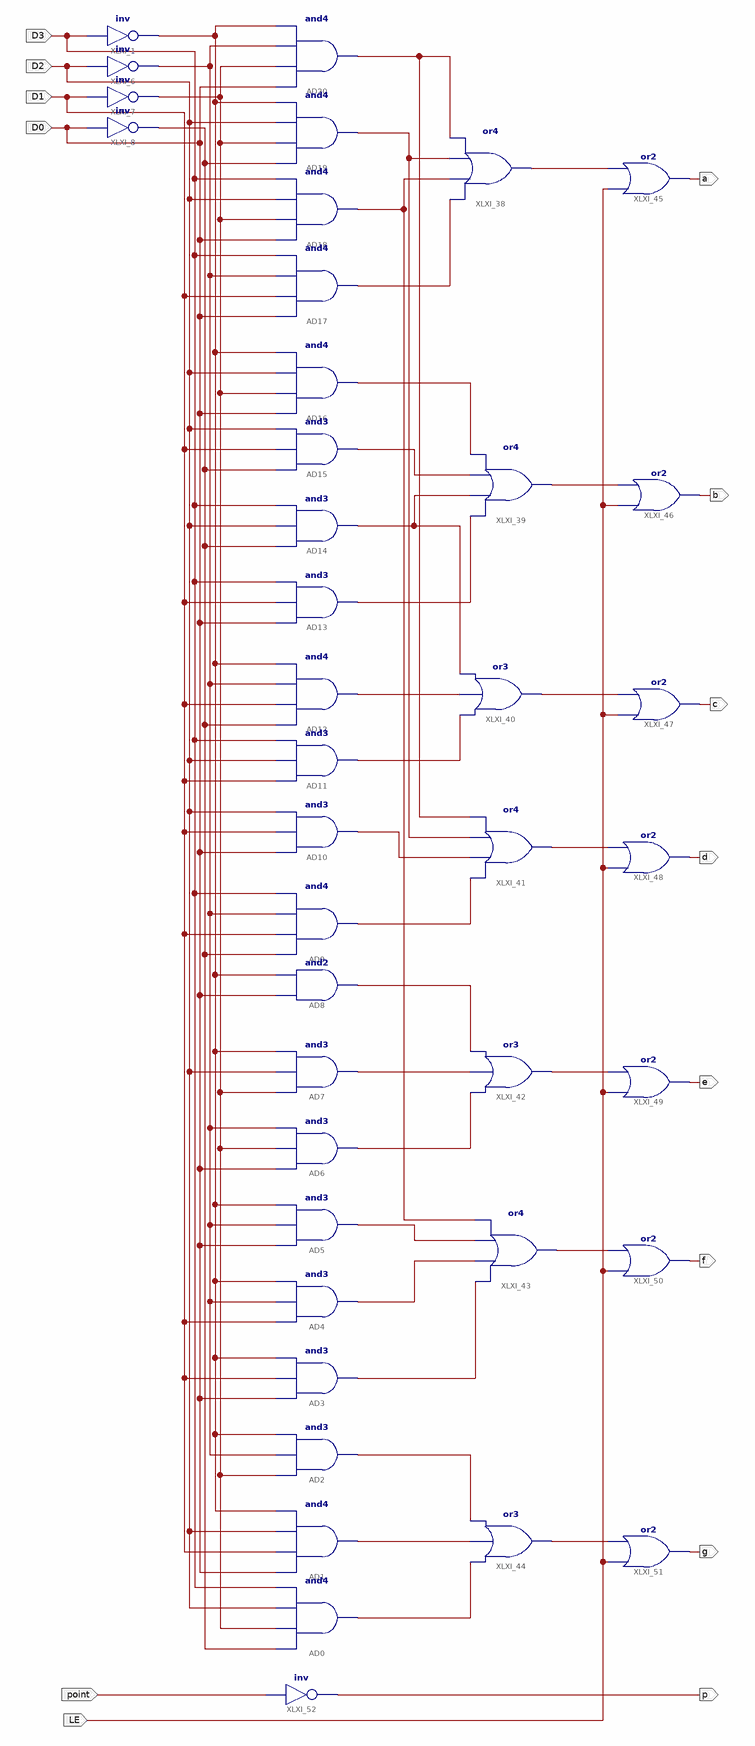
[diagram p0: schematic sheet 1]
// Xilinx ISE schematic MyMC14495.sch (kintex7) as structural Verilog: 40 symbols, 14 ports
module MyMC14495 (
  input  D3,
  input  D2,
  input  D1,
  input  D0,
  input  LE,
  input  point,
  output p,
  output a,
  output b,
  output c,
  output d,
  output e,
  output f,
  output g
);

  wire XLXN_5, XLXN_16, XLXN_38, XLXN_55, XLXN_73, XLXN_74, XLXN_75, XLXN_76, XLXN_77, XLXN_78, XLXN_79,
       XLXN_80, XLXN_84, XLXN_85, XLXN_90, XLXN_91, XLXN_92, XLXN_93, XLXN_94, XLXN_95, XLXN_96, XLXN_97,
       XLXN_98, XLXN_99, XLXN_100, XLXN_101, XLXN_102, XLXN_103, XLXN_104, XLXN_105, XLXN_106, XLXN_107;

  not XLXI_1 (XLXN_5, D3);
  and AD20 (XLXN_73, D0, XLXN_38, XLXN_16, XLXN_5);
  and AD19 (XLXN_74, XLXN_55, XLXN_38, D2, XLXN_5);
  and AD18 (XLXN_75, D0, XLXN_38, D2, D3);
  and AD17 (XLXN_76, D0, D1, XLXN_16, D3);
  not XLXI_6 (XLXN_16, D2);
  not XLXI_7 (XLXN_38, D1);
  not XLXI_8 (XLXN_55, D0);
  and AD16 (XLXN_77, D0, XLXN_38, D2, XLXN_5);
  and AD12 (XLXN_84, XLXN_55, D1, XLXN_16, XLXN_5);
  and AD9 (XLXN_91, XLXN_55, D1, XLXN_16, D3);
  and AD1 (XLXN_99, D0, D1, D2, XLXN_5);
  and AD0 (XLXN_100, XLXN_55, XLXN_38, D2, D3);
  and AD11 (XLXN_85, D1, D2, D3);
  and AD10 (XLXN_90, D0, D1, D2);
  and AD8 (XLXN_92, D0, XLXN_5);
  and AD7 (XLXN_93, XLXN_38, D2, XLXN_5);
  and AD6 (XLXN_94, D0, XLXN_38, XLXN_16);
  and AD5 (XLXN_95, D0, XLXN_16, XLXN_5);
  and AD4 (XLXN_96, D1, XLXN_16, XLXN_5);
  and AD3 (XLXN_97, D0, D1, XLXN_5);
  and AD2 (XLXN_98, XLXN_38, XLXN_16, XLXN_5);
  and AD15 (XLXN_78, XLXN_55, D1, D2);
  and AD14 (XLXN_79, XLXN_55, D2, D3);
  and AD13 (XLXN_80, D0, D1, D3);
  or XLXI_38 (XLXN_101, XLXN_76, XLXN_75, XLXN_74, XLXN_73);
  or XLXI_39 (XLXN_102, XLXN_80, XLXN_79, XLXN_78, XLXN_77);
  or XLXI_40 (XLXN_103, XLXN_85, XLXN_84, XLXN_79);
  or XLXI_41 (XLXN_104, XLXN_91, XLXN_90, XLXN_74, XLXN_73);
  or XLXI_42 (XLXN_105, XLXN_94, XLXN_93, XLXN_92);
  or XLXI_43 (XLXN_107, XLXN_97, XLXN_96, XLXN_95, XLXN_75);
  or XLXI_44 (XLXN_106, XLXN_100, XLXN_99, XLXN_98);
  or XLXI_45 (a, LE, XLXN_101);
  or XLXI_46 (b, LE, XLXN_102);
  or XLXI_47 (c, LE, XLXN_103);
  or XLXI_48 (d, LE, XLXN_104);
  or XLXI_49 (e, LE, XLXN_105);
  or XLXI_50 (f, LE, XLXN_107);
  or XLXI_51 (g, LE, XLXN_106);
  not XLXI_52 (p, point);
endmodule
